# Altium schematic sheet z-probe.SchDoc
size 254 x 172 mm
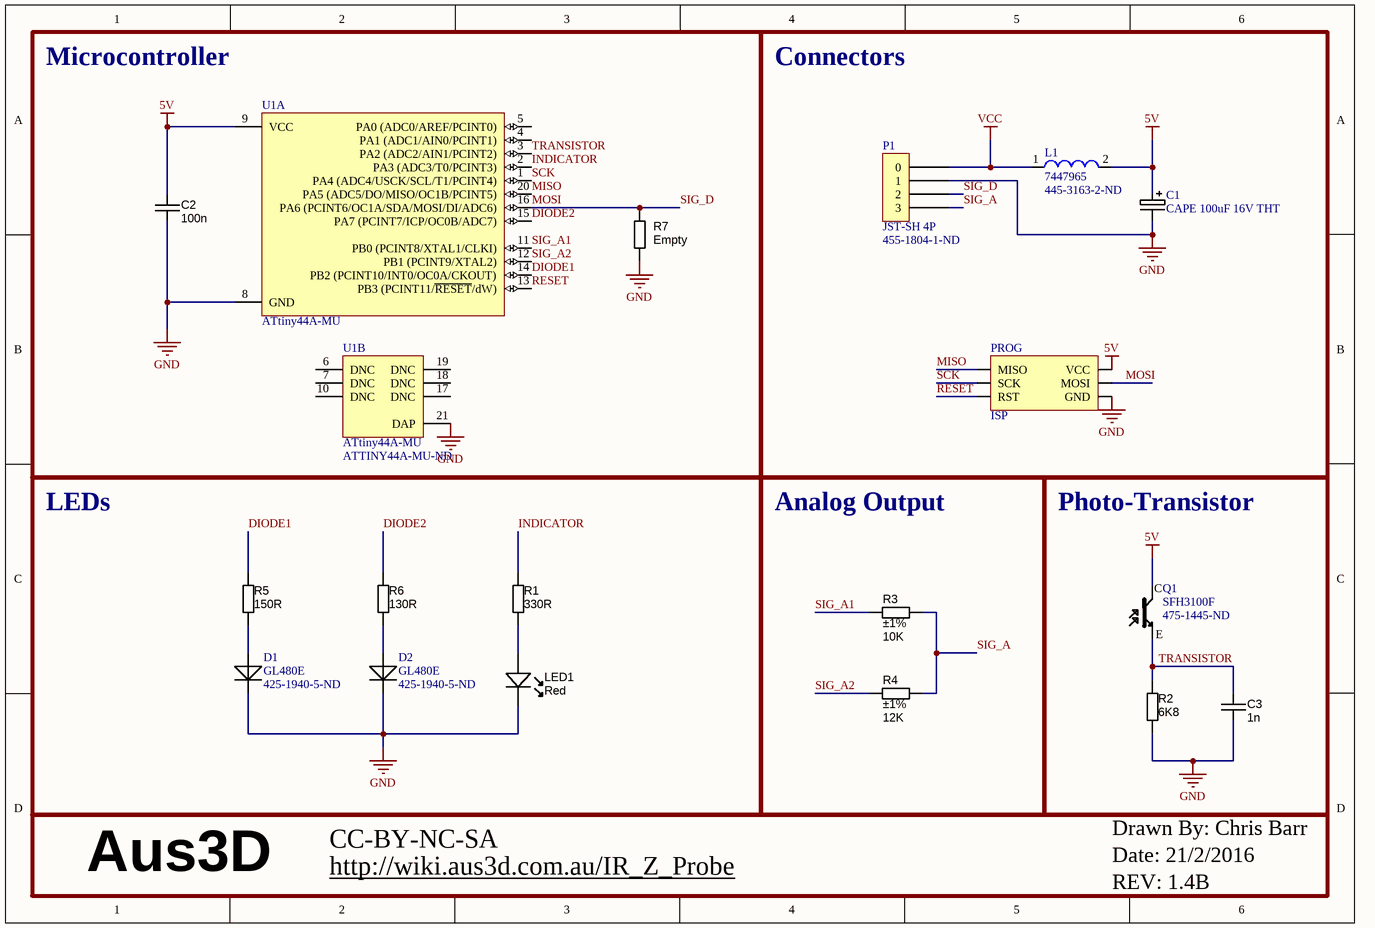
[diagram p0: z-probe.SchDoc]

## Parts
C1  CAPE 100uF 16V THT  [6-DIA-CAP]
C2  value 100n  [CAPC1608X90N]  (hidden comment: approved sub OK)
C3  value 1n  [CAPC1608X90N]  (hidden comment: approved sub OK)
D1  GL480E  Supplier Part Number 1: 425-1940-5-ND  [LED-2.54spacing]
D2  GL480E  Supplier Part Number 1: 425-1940-5-ND  [LED-2.54spacing]
L1  7447965  Supplier Part Number 1: 445-3163-2-ND  [SMD-0603]
LED1  Red  [LED-0603-RED]
P1  JST-SH 4P  Supplier Part Number 1: 455-1804-1-ND  [SM04B-SRSS-TB]
PROG  ISP  [ICSP Pads]  (no BOM)
Q1  SFH3100F  Supplier Part Number 1: 475-1445-ND  [SFH3100F-footprint]
R1  value 330R  [RESC1608X55N]  (hidden comment: Thick Film)
R2  value 6K8  [RESC1608X55N]  (hidden comment: Thick Film)
R3  value 10K  Tolerance: ±1%  [RESC1608X55N]  (hidden comment: Thick Film)
R4  value 12K  Tolerance: ±1%  [RESC1608X55N]  (hidden comment: Thick Film)
R5  value 150R  [RESC1608X55N]  (hidden comment: Thick Film)
R6  value 130R  [RESC1608X55N]  (hidden comment: Thick Film)
R7  Empty  [RESC2012X70N]
U1  ATtiny44A-MU  [20M1_N]  (parts A,B of 2)

## Blocks framed on the sheet
Microcontroller: C2 R7 U1
Connectors: C1 L1 P1 PROG
LEDs: D1 D2 LED1 R1 R5 R6
Analog Output: R3 R4
Photo-Transistor: C3 Q1 R2

## Nets
5V: C1.1 C2.2 L1.2 PROG.1(VCC) Q1.1 U1.9(VCC)
GND: C1.0 C2.1 C3.2 D1.1 D2.1 LED1.K P1.1 PROG.5(GND) R2.1 R7.2 U1.8(GND) U1.21(DAP)
VCC: L1.1 P1.0
DIODE1: R5.2 U1.14(PB2_(PCINT10/INT0/OC0A/CKOUT))
DIODE2: R6.2 U1.15(PA7_(PCINT7/ICP/OC0B/ADC7))
INDICATOR: R1.1 U1.2(PA3_(ADC3/T0/PCINT3))
MISO: PROG.0(MISO) U1.20(PA5_(ADC5/DO/MISO/OC1B/PCINT5))
MOSI: P1.2 PROG.3(MOSI) R7.1 U1.16(PA6_(PCINT6/OC1A/SDA/MOSI/DI/ADC6))  [also labelled SIG_D]
RESET: PROG.4(RST) U1.13(PB3_(PCINT11/~{RESET}/dW))
SCK: PROG.2(SCK) U1.1(PA4_(ADC4/USCK/SCL/T1/PCINT4))
SIG_A: P1.3 R3.2 R4.2
SIG_A1: R3.1 U1.11(PB0_(PCINT8/XTAL1/CLKI))
SIG_A2: R4.1 U1.12(PB1_(PCINT9/XTAL2))
TRANSISTOR: C3.1 Q1.2 R2.2 U1.3(PA2_(ADC2/AIN1/PCINT2))
NetD1_2: D1.2 R5.1
NetD2_2: D2.2 R6.1
NetLED1_A: LED1.A R1.2

Not connected (* = marked no-connect by the designer): U1 4(PA1_(ADC1/AIN0/PCINT1)) 5(PA0_(ADC0/AREF/PCINT0)) 6(DNC) 7(DNC) 10(DNC) 17(DNC) 18(DNC) 19(DNC)

## Notes on the sheet
- Aus3D
- http://wiki.aus3d.com.au/IR_Z_Probe
- CC-BY-NC-SA
- Drawn By: Chris Barr
- Date: 21/2/2016
- REV: 1.4B
- (in symbol SFH3100F) C; E

## Library data of the parts
C2 = CAPC_100n_0603_X7R_50V_10%: Capacitor SMD Cer 100nF 10% 50V X7R 0603; Manufacturer 1: AVX Corporation; Manufacturer Part Number 1: 06035C104KAT2A; Ratings: 50V; X7R; Material: ceramic; SCDType: spec; Manufacturer 2: TDK Corporation; Manufacturer Part Number 2: C1608X7R1H104K; Package / Case: 0603 (1608 Metric); Tolerance: ±10%; Supplier 1: Digi-Key; Supplier Part Number 1: 478-5052-1-ND; ComponentLink1URL: http://www.avx.com/docs/Catalogs/cx7r.pdf; ComponentLink1Description: http://www.avx.com/docs/Catalogs/cx7r.pdf; Supplier 2: Digi-Key; Supplier Part Number 2: 445-1314-1-ND; ComponentLink2URL: http://product.tdk.com/capacitor/mlcc/en/documents/mlcc_commercial_general_en.pdf; ComponentLink2Description: http://product.tdk.com/capacitor/mlcc/en/documents/mlcc_commercial_general_en.pdf
C3 = CAPC_1n_0603_X7R_100V_10%: Capacitor SMD Cer 1nF 10% 100V X7R 0603; Manufacturer 1: Murata Electronics North America; Manufacturer Part Number 1: GCM188R72A102KA37D; Ratings: 100V; X7R; Material: ceramic; SCDType: spec; Package / Case: 0603 (1608 metric); Tolerance: ±10%; Supplier 1: Digi-Key; Supplier Part Number 1: 490-4780-1-ND; Operating Temperature: -55°C ~ 125°C; Size / Dimension: 0.063" L x 0.031" W (1.60mm x 0.80mm); Thickness (Max): 0.035" (0.90mm); ComponentLink1URL: http://search.murata.co.jp/Ceramy/image/img/PDF/ENG/GCM188R72A102KA37.pdf; ComponentLink1Description: http://search.murata.co.jp/Ceramy/image/img/PDF/ENG/GCM188R72A102KA37.pdf
L1 = 7447965: SMD-Multilayer Inductor WE-MI, L = 1.00 µH; Inductance: 1.00 µH; DatasheetVersion: ver 5, Oct-2004; PackageVersion: 2009; PackageReference: SMD-0603; PackageDescription: Chip Inductor, 2-Leads, Body 1.6 x 0.8 mm; ComponentLink1Description: Manufacturer URL; ComponentLink1URL: http://www.we-online.com; ComponentLink2Description: Datasheet; ComponentLink2URL: http://www.we-online.de/katalog/media/pdf/7447965.pdf; Supplier 1: Digi-Key
LED1 = LED_SMD_Red_0603_220mcd: LED 0603 SMD Hyper Red 630nm 220mcd 20mA; Manufacturer 1: Kingbright Company LLC; Manufacturer Part Number 1: APT1608SURCK; Material: AlGaInP on GaAs; Ratings: 220 mcd; 630 nm; Voltage - Forward (Vf) Typ: 1.95V; Voltage - Forward (Vf) @ 10mA: 1.9V; SCDType: source; Package / Case: 0603 (1608 metric); Supplier 1: Digi-Key; Supplier Part Number 1: 754-1123-1-ND; ComponentLink1URL: http://www.us.kingbright.com/images/catalog/SPEC/APT1608SURCK.pdf; ComponentLink1Description: http://www.us.kingbright.com/images/catalog/SPEC/APT1608SURCK.pdf
P1 = SM04B-SRSS-TB: Supplier 1: Digi-Key
PROG = ISP Header
R1 = RES_330R_0603_5%: Resistor SMD chip 330 Ohm 0.1W 5% 0603; Manufacturer 1: Vishay Dale; Manufacturer Part Number 1: CRCW0603330RJNEA; Ratings: 1/10 W; SCDType: spec; Manufacturer 2: Yageo; Manufacturer Part Number 2: RC0603JR-07330RL; Package / Case: 0603 (1608 metric); Tolerance: ±5%; Material: Thick Film; Supplier 1: Digi-Key; Supplier Part Number 1: 541-330GCT-ND; ComponentLink1URL: http://www.vishay.com/doc?20035; ComponentLink1Description: http://www.vishay.com/doc?20035; Supplier 2: Digi-Key; Supplier Part Number 2: 311-330GRCT-ND; ComponentLink2URL: http://www.yageo.com/documents/recent/PYu-RC0603_51_RoHS_L_4.pdf; ComponentLink2Description: http://www.yageo.com/documents/recent/PYu-RC0603_51_RoHS_L_4.pdf; Supplier: http://au.rs-online.com/web/p/surface-mount-fixed-resistors/6790226/
R2 R5 R6 = RES_2K2_0603_5%: Resistor SMD chip 2.2k Ohm 0.1W 5% 0603; Manufacturer 1: Yageo; Manufacturer Part Number 1: RC0603JR-072K2L; Ratings: 1/10 W; SCDType: spec; Temperature Coefficient: ±100ppm/°C; Package / Case: 0603 (1608 metric); Tolerance: ±5%; Material: Thick Film; Supplier 1: Digi-Key; Supplier Part Number 1: 311-2.2KGRDKR-ND; RoHS 1: RoHS Compliant; ComponentLink1URL: http://www.yageo.com/documents/recent/PYu-RC0603_51_RoHS_L_4.pdf; ComponentLink1Description: http://www.yageo.com/documents/recent/PYu-RC0603_51_RoHS_L_4.pdf; Supplier 2: Digi-Key; Supplier Part Number 2: 1276-5070-6-ND; Manufacturer 2: Samsung Electro-Mechanics America, Inc; Manufacturer Part Number 2: RC1608J222CS; RoHS 2: RoHS Compliant; ComponentLink2URL: http://www.samsungsem.com/servlet/FileDownload?filename=productcatalog/pdf/Chip_Resistor.pdf; ComponentLink2Description: http://www.samsungsem.com/servlet/FileDownload?filename=productcatalog/pdf/Chip_Resistor.pdf; Supplier 3: Digi-Key; Supplier Part Number 3: RMCF0603JT2K20DKR-ND; Manufacturer 3: Stackpole Electronics Inc; Manufacturer Part Number 3: RMCF0603JT2K20; RoHS 3: RoHS Compliant; ComponentLink3URL: http://www.seielect.com/Catalog/SEI-RMCF_RMCP.pdf; ComponentLink3Description: http://www.seielect.com/Catalog/SEI-RMCF_RMCP.pdf; Supplier 4: Digi-Key; Supplier Part Number 4: RHM2.2KCGDKR-ND; Manufacturer 4: Rohm Semiconductor; Manufacturer Part Number 4: MCR03ERTJ222; RoHS 4: RoHS Compliant; ComponentLink4URL: http://rohmfs.rohm.com/en/products/databook/datasheet/passive/resistor/chip_resistor/mcr_g.pdf; ComponentLink4Description: http://rohmfs.rohm.com/en/products/databook/datasheet/passive/resistor/chip_resistor/mcr_g.pdf; Supplier 5: Digi-Key; Supplier Part Number 5: P2.2KGDKR-ND; Manufacturer 5: Panasonic Electronic Components; Manufacturer Part Number 5: ERJ-3GEYJ222V; RoHS 5: RoHS Compliant; ComponentLink5URL: http://industrial.panasonic.com/www-cgi/jvcr13pz.cgi?E+PZ+3+AOA0001+ERJ3GEYJ222V+7+WW; ComponentLink5Description: http://industrial.panasonic.com/www-cgi/jvcr13pz.cgi?E+PZ+3+AOA0001+ERJ3GEYJ222V+7+WW
  R2: Supplier: http://au.rs-online.com/web/p/surface-mount-fixed-resistors/8102303/
  R5: Supplier: http://au.rs-online.com/web/p/surface-mount-fixed-resistors/6789784/
  R6: Supplier: http://au.rs-online.com/web/p/surface-mount-fixed-resistors/8102129/
R3 R4 = RES_10K_0603_1%: Resistor SMD chip 10k Ohm 0.1W 1% 0603; Manufacturer 1: Yageo; Manufacturer Part Number 1: RC0603FR-0710KL; Ratings: 1/10W; SCDType: spec; Package / Case: 0603 (1608 Metric); Supplier 1: Digi-Key; Supplier Part Number 1: 311-10.0KHRCT-ND
R7 = RES_EMPTY_0805: Resistor, 0805 SMD, Empty footprint; Value: N/A; Package / Case: 0805 (2012 metric)
U1 = ATtiny44A-MU: 8-bit AVR Microcontroller,  20MHz, 1.8-5.5V, 4KB Flash, 256 Bytes EEPROM, 256 Bytes SRAM, 20-pin MLF, Industrial Grade (-40°C to 85°C), Pb-Free; DatasheetVersion: revD, Apr-2011; PackageVersion: revA, Oct-2004; PackageReference: 20M1; PackageDescription: 20-pad, 4 x 4 x 0.8 mm Body, Lead Pitch 0.50 mm, 2.6 mm Exposed Pad, Micro Lead Frame Package (MLF); Code_JEDEC: MO-220WGGD-5; ComponentLink1Description: Manufacturer URL; ComponentLink1URL: http://www.atmel.com/; ComponentLink2Description: ATtiny24A/44A/84A Datasheet; ComponentLink2URL: http://www.atmel.com/dyn/resources/prod_documents/doc8183.pdf; ComponentLink3Description: ATtiny24A/44A/84A Summary; ComponentLink3URL: http://www.atmel.com/dyn/resources/prod_documents/8183S.pdf; Supplier 1: Digi-Key; Supplier Part Number 1: ATTINY44A-MU-ND
C1 = CAPE 100uF 16V THT: Supplier 1: Digi-Key; Supplier Part Number 1: 399-6648-1-ND
D1 D2 = GL480E: Supplier 1: Digi-Key
Q1 = SFH3100F: Supplier 1: Digi-Key